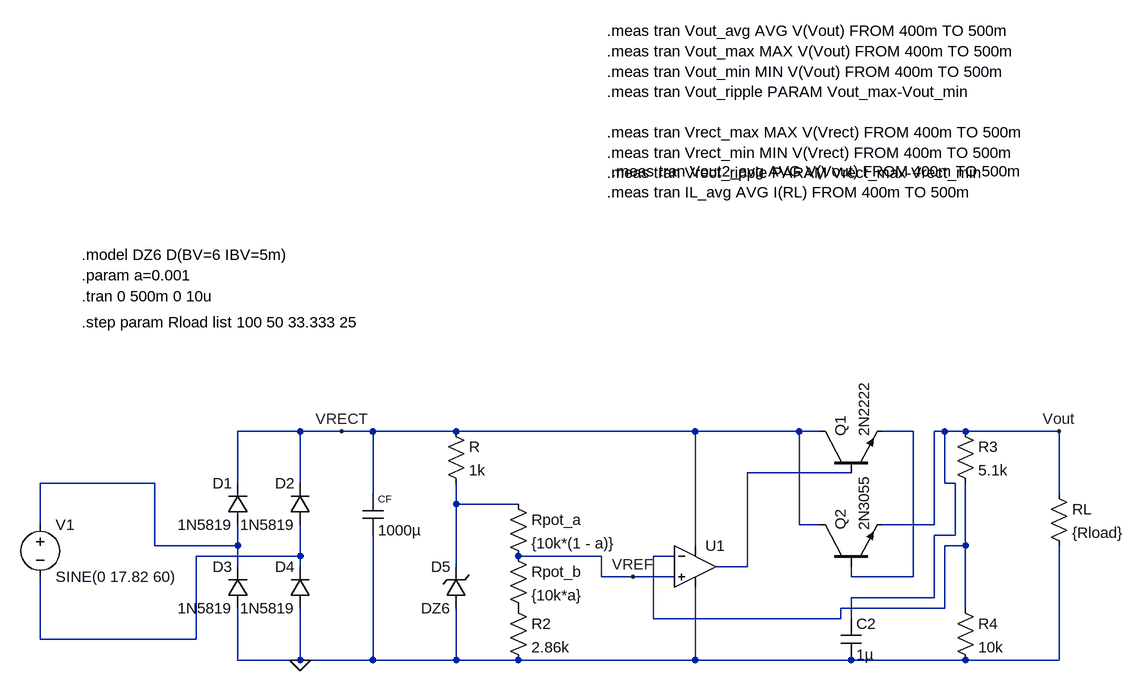
[diagram p0: schematic adjustable_dc_power_supply.asc]
adjustable_dc_power_supply.asc, the LTspice schematic file:
Version 4.1
SHEET 1 1588 680
WIRE 304 -176 208 -176
WIRE 368 -176 304 -176
WIRE 416 -176 368 -176
WIRE 544 -176 416 -176
WIRE 912 -176 544 -176
WIRE 1072 -176 912 -176
WIRE 1104 -176 1072 -176
WIRE 1248 -176 1200 -176
WIRE 1296 -176 1280 -176
WIRE 1328 -176 1296 -176
WIRE 1472 -176 1328 -176
WIRE 1152 -112 992 -112
WIRE 80 -96 -96 -96
WIRE 208 -96 208 -176
WIRE 304 -96 304 -176
WIRE 1296 -96 1296 -176
WIRE 1312 -96 1296 -96
WIRE 416 -80 416 -176
WIRE 1472 -80 1472 -176
WIRE 544 -64 544 -96
WIRE 640 -64 544 -64
WIRE -96 -32 -96 -96
WIRE 1072 -32 1072 -176
WIRE 1104 -32 1072 -32
WIRE 1280 -32 1280 -176
WIRE 1280 -32 1200 -32
WIRE 1312 -16 1312 -96
WIRE 1312 -16 1280 -16
WIRE 80 0 80 -96
WIRE 208 0 208 -32
WIRE 208 0 80 0
WIRE 912 0 912 -176
WIRE 1328 0 1328 -96
WIRE 1328 0 1296 0
WIRE 304 16 304 -32
WIRE 304 16 144 16
WIRE 768 16 640 16
WIRE 880 16 848 16
WIRE 208 32 208 0
WIRE 304 32 304 16
WIRE 544 32 544 -64
WIRE 992 32 992 -112
WIRE 992 32 944 32
WIRE 768 48 768 16
WIRE 816 48 768 48
WIRE 880 48 816 48
WIRE 1152 48 1152 32
WIRE 1248 48 1248 -176
WIRE 1248 48 1152 48
WIRE 1280 80 1280 -16
WIRE 1280 80 1152 80
WIRE 1296 96 1296 0
WIRE 1296 96 1136 96
WIRE 1328 96 1328 0
WIRE 848 112 848 16
WIRE 1136 112 1136 96
WIRE 1136 112 848 112
WIRE 1152 112 1152 80
WIRE -96 144 -96 48
WIRE 144 144 144 16
WIRE 144 144 -96 144
WIRE 208 176 208 96
WIRE 304 176 304 96
WIRE 304 176 208 176
WIRE 416 176 416 -16
WIRE 416 176 304 176
WIRE 544 176 544 96
WIRE 544 176 416 176
WIRE 640 176 544 176
WIRE 912 176 912 64
WIRE 912 176 640 176
WIRE 1152 176 912 176
WIRE 1328 176 1152 176
WIRE 1472 176 1472 0
WIRE 1472 176 1328 176
FLAG 304 176 0
FLAG 1472 -176 Vout
FLAG 368 -176 VRECT
FLAG 816 48 VREF
SYMBOL voltage -96 -48 R0
WINDOW 123 0 0 Left 0
WINDOW 39 0 0 Left 0
SYMATTR InstName V1
SYMATTR Value SINE(0 17.82 60)
SYMBOL diode 224 -32 R180
WINDOW 0 24 64 Left 2
WINDOW 3 24 0 Left 2
SYMATTR InstName D1
SYMATTR Value 1N5819
SYMBOL diode 320 -32 R180
WINDOW 0 24 64 Left 2
WINDOW 3 24 0 Left 2
SYMATTR InstName D2
SYMATTR Value 1N5819
SYMBOL diode 224 96 R180
WINDOW 0 24 64 Left 2
WINDOW 3 24 0 Left 2
SYMATTR InstName D3
SYMATTR Value 1N5819
SYMBOL diode 320 96 R180
WINDOW 0 24 64 Left 2
WINDOW 3 24 0 Left 2
SYMATTR InstName D4
SYMATTR Value 1N5819
SYMBOL cap 400 -80 R0
WINDOW 0 24 8 Left 1
SYMATTR InstName CF
SYMATTR Value 1000µ
SYMBOL res 528 -192 R0
SYMATTR InstName R
SYMATTR Value 1k
SYMBOL zener 560 96 R180
WINDOW 0 24 64 Left 2
WINDOW 3 24 0 Left 2
SYMATTR InstName D5
SYMATTR Value DZ6
SYMBOL res 624 80 R0
SYMATTR InstName R2
SYMATTR Value 2.86k
SYMBOL res 624 -80 R0
SYMATTR InstName Rpot_a
SYMATTR Value {10k*(1 - a)}
SYMBOL res 624 0 R0
SYMATTR InstName Rpot_b
SYMATTR Value {10k*a}
SYMBOL npn 1104 -112 R270
SYMATTR InstName Q1
SYMATTR Value 2N2222
SYMBOL npn 1104 32 R270
SYMATTR InstName Q2
SYMATTR Value 2N3055
SYMBOL cap 1136 112 R0
SYMATTR InstName C2
SYMATTR Value 1µ
SYMBOL res 1312 -192 R0
SYMATTR InstName R3
SYMATTR Value 5.1k
SYMBOL res 1312 80 R0
SYMATTR InstName R4
SYMATTR Value 10k
SYMBOL res 1456 -96 R0
SYMATTR InstName RL
SYMATTR Value {Rload}
SYMBOL OpAmps\\UniversalOpAmp2 912 32 R0
SYMATTR InstName U1
SYMATTR Value2 Avol=1Meg GBW=10k Slew=10Meg
TEXT -32 -448 Left 2 !.model DZ6 D(BV=6 IBV=5m)
TEXT -32 -416 Left 2 !.param a=0.001
TEXT -32 -384 Left 2 !.tran 0 500m 0 10u
TEXT -32 -344 Left 2 !.step param Rload list 100 50 33.333 25
TEXT 776 -792 Left 2 !.meas tran Vout_avg AVG V(Vout) FROM 400m TO 500m\n.meas tran Vout_max MAX V(Vout) FROM 400m TO 500m\n.meas tran Vout_min MIN V(Vout) FROM 400m TO 500m\n.meas tran Vout_ripple PARAM Vout_max-Vout_min\n \n.meas tran Vrect_max MAX V(Vrect) FROM 400m TO 500m\n.meas tran Vrect_min MIN V(Vrect) FROM 400m TO 500m\n.meas tran Vrect_ripple PARAM Vrect_max-Vrect_min
TEXT 776 -544 Left 2 !.meas tran IL_avg AVG I(RL) FROM 400m TO 500m
TEXT 784 -576 Left 2 !.meas tran Vout2_avg AVG V(Vout) FROM 400m TO 500m

The netlist it stands for:
* adjustable_dc_power_supply.asc
V1 N003 N006 SINE(0 17.82 60)
D1 N003 VRECT 1N5819
D2 N006 VRECT 1N5819
D3 0 N003 1N5819
D4 0 N006 1N5819
CF VRECT 0 1000µ
R VRECT N004 1k
D5 0 N004 DZ6
R2 P001 0 2.86k
Rpot_a N004 VREF {10k*(1 - a)}
Rpot_b VREF P001 {10k*a}
Q1 VRECT N002 N001 0 2N2222
Q2 VRECT N001 Vout 0 2N3055
C2 Vout 0 1µ
R3 Vout N005 5.1k
R4 N005 0 10k
RL Vout 0 {Rload}
X§U1 VREF N005 VRECT 0 N002 level2 Avol=1Meg GBW=10k Slew=10Meg Ilimit=25m Rail=0 Vos=0 En=0 Enk=0 In=0 Ink=0 Rin=500Meg  ; pins In+ In- V+ V- OUT
.model D D
.lib standard.dio
.model NPN NPN
.model PNP PNP
.lib standard.bjt
.model DZ6 D(BV=6 IBV=5m)
.param a=0.001
.tran 0 500m 0 10u
.step param Rload list 100 50 33.333 25
.meas tran Vout_avg AVG V(Vout) FROM 400m TO 500m
.meas tran Vout_max MAX V(Vout) FROM 400m TO 500m
.meas tran Vout_min MIN V(Vout) FROM 400m TO 500m
.meas tran Vout_ripple PARAM Vout_max-Vout_min
.meas tran Vrect_max MAX V(Vrect) FROM 400m TO 500m
.meas tran Vrect_min MIN V(Vrect) FROM 400m TO 500m
.meas tran Vrect_ripple PARAM Vrect_max-Vrect_min
.meas tran IL_avg AVG I(RL) FROM 400m TO 500m
.meas tran Vout2_avg AVG V(Vout) FROM 400m TO 500m
.lib UniversalOpAmp2.lib
.backanno
.end